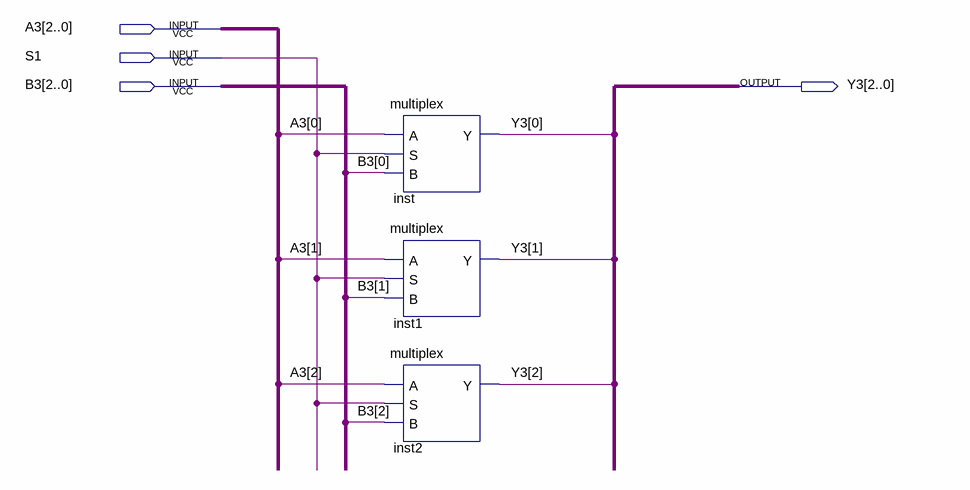
[diagram p0: schematic sheet]
// Quartus schematic multiplex3.bdf as structural Verilog: 3 symbols, 4 pins
module multiplex3 (
  input  [2:0] A3,
  input  S1,
  input  [2:0] B3,
  output [2:0] Y3
);

  multiplex inst (.A(A3[0]), .S(S1), .B(B3[0]), .Y(Y3[0]));
  multiplex inst1 (.A(A3[1]), .S(S1), .B(B3[1]), .Y(Y3[1]));
  multiplex inst2 (.A(A3[2]), .S(S1), .B(B3[2]), .Y(Y3[2]));
endmodule
